# Altium schematic sheet ChopperAmp.SchDoc
size A3; Author: P Shersby; SheetNumber: 1; SheetTotal: 1; DocumentName: Sampling Gate Assembly
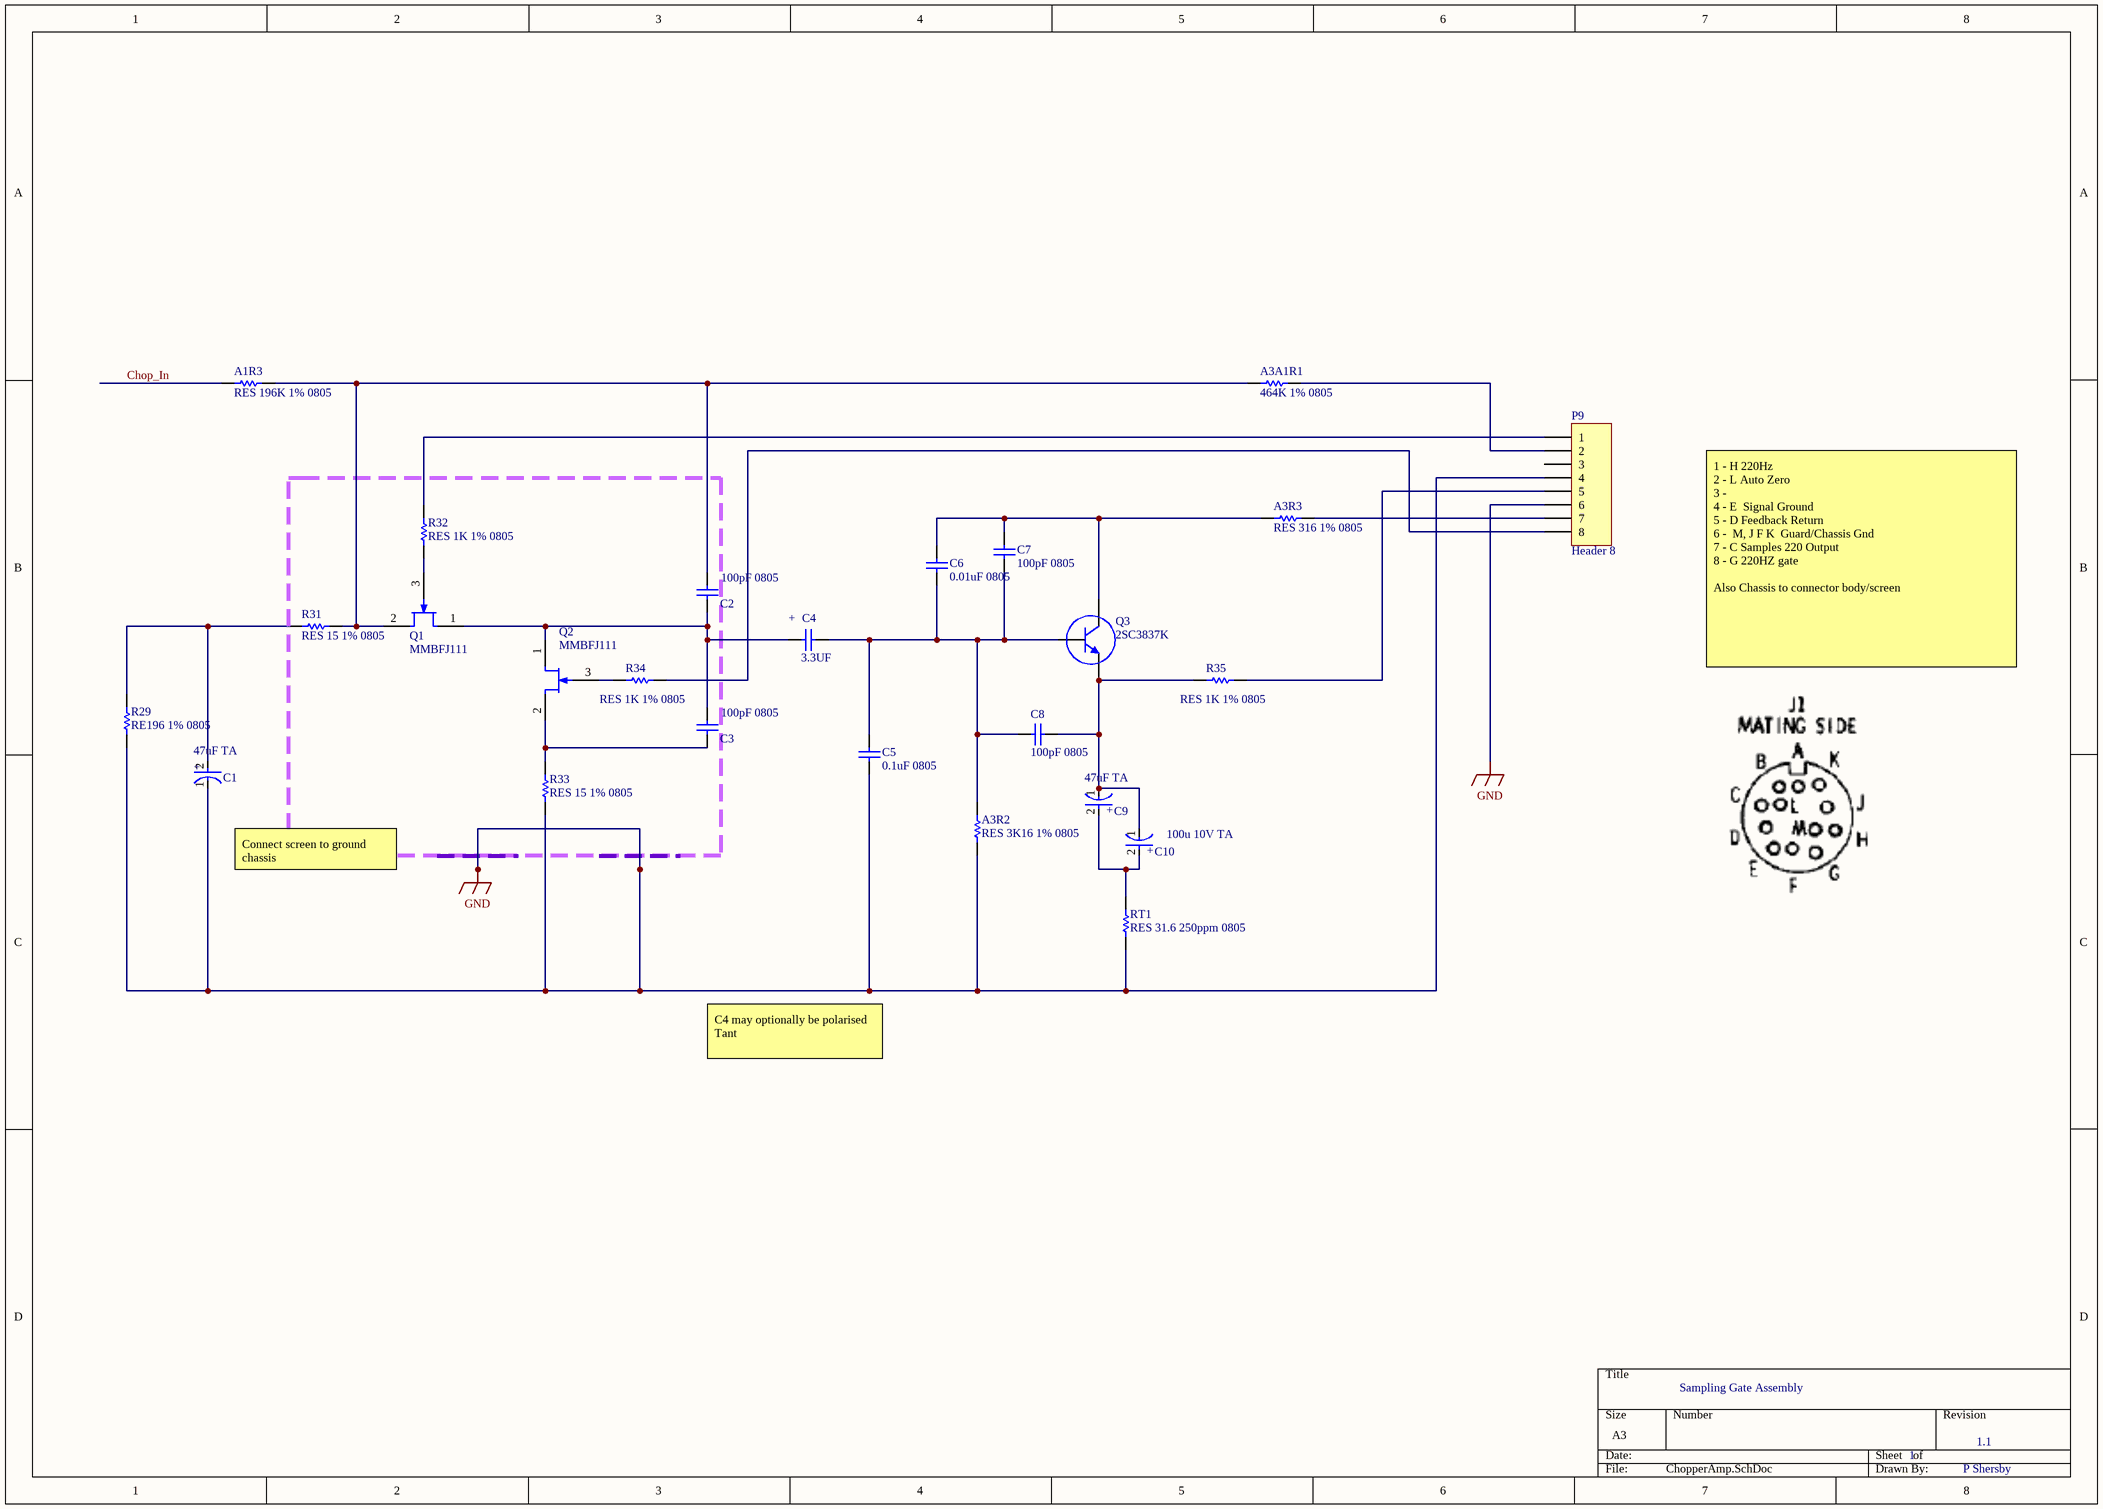
[diagram p0: ChopperAmp.SchDoc]

## Parts
A1R3  RES 196K 1% 0805  [RESC2013X70X40LL20T20]
A3A1R1  464K 1% 0805  [RESC2013X70X40LL20T20]
A3R2  RES 3K16 1% 0805  [RESC2013X70X40LL20T20]
A3R3  RES 316 1% 0805  [RESC2013X70X40LL20T20]
C1  47uF TA  [FP-TAJB-MFG]
C2  100pF 0805  [CAPC2113X88X50NL30T25]
C3  100pF 0805  [CAPC2113X88X50NL30T25]
C4  3.3UF  [CAPC1206(3216)150_L]
C5  0.1uF 0805  [CAPC2113X88X50NL30T25]
C6  0.01uF 0805  [CAPC2113X88X50NL30T25]
C7  100pF 0805  [CAPC2113X88X50NL30T25]
C8  100pF 0805  [CAPC2113X88X50NL30T25]
C9  47uF TA  [FP-TAJB-MFG]
C10  100u 10V TA  [FP-TPE-D4-MFG]
P9  Header 8  [HDR1X8]
Q1  MMBFJ111  [ONSC-SOT-23-3-318-08_V]
Q2  MMBFJ111  [ONSC-SOT-23-3-318-08_V]
Q3  2SC3837K  [SC-59]
R29  RE196 1% 0805  [RESC2013X70X40LL20T20]
R31  RES 15 1% 0805  [RESC2013X70X40LL20T20]
R32  RES 1K 1% 0805  [RESC2013X70X40LL20T20]
R33  RES 15 1% 0805  [RESC2013X70X40LL20T20]
R34  RES 1K 1% 0805  [RESC2013X70X40LL20T20]
R35  RES 1K 1% 0805  [RESC2013X70X40LL20T20]
RT1  RES 31.6 250ppm 0805  [RESC2013X70X40LL20T20]
SC1  ScreenConnection  [ScreenConnection]  (value not drawn)
SC2  ScreenConnection  [ScreenConnection]  (value not drawn)

## Nets
GND: A3R2.1 C1.1(C) C5.2 P9.4 P9.6 R29.2 R33.2 RT1.1 SC1.1 SC2.1
Chop_In: A1R3.1
NetA1R3_2: A1R3.2 A3A1R1.1 C2.2 Q1.2(S) R31.1
NetA3A1R1_2: A3A1R1.2 P9.2
NetA3R2_2: A3R2.2 C4.2 C5.1 C6.2 C7.2 C8.2 Q3.2(B)
NetA3R3_1: A3R3.1 C6.1 C7.1 Q3.1(C)
NetA3R3_2: A3R3.2 P9.7
NetC1_2: C1.2(A) R29.1 R31.2
NetC2_1: C2.1 C3.2 C4.1 Q1.1(D) Q2.1(D)
NetC3_1: C3.1 Q2.2(S) R33.1
NetC8_1: C8.1 C9.1(C) C10.1(C) Q3.3(E) R35.1
NetC9_2: C9.2(A) C10.2(A) RT1.2
NetP9_1: P9.1 R32.1
NetP9_5: P9.5 R35.2
NetP9_8: P9.8 R34.2
NetQ1_3: Q1.3(G) R32.2
NetQ2_3: Q2.3(G) R34.1

Not connected (* = marked no-connect by the designer): P9 3

## Notes on the sheet
- (near C4) +
- 1 - H 220Hz
  2 - L Auto Zero
  3 -
  4 - E  Signal Ground
  5 - D Feedback Return
  6 -  M, J F K  Guard/Chassis Gnd
  7 - C Samples 220 Output
  8 - G 220HZ gate
  Also Chassis to connector body/screen
- Connect screen to ground chassis
- C4 may optionally be polarised Tant
- 1.1
- (in symbol CMP-04424-000035-1) +
- (in symbol CMP-05428-000010-1) +

## Library data of the parts
A1R3 = CMP-2001-00110-5: Resistor 196K 1% 0805  1/8W 10ppm/C; Manufacturer: Panasonic; Voltage Rating: 150 V; Package Quantity: 5000; PackageDescription: 2-Pin Surface Mount Device, Body 2 x 1.25 mm; Mounting Technology: Surface Mount; ComponentLink2URL: http://industrial.panasonic.com/cdbs/www-data/pdf/RDA0000/AOA0000C86.pdf; DatasheetVersion: 04/2015; ComponentLink1URL: http://www.panasonic.com/; Mount: Surface Mount; ComponentLink1Description: Manufacturer URL; RoHSCompliant: true; PackageReference: 0805; Min Operating Temperature: -55 degC; Height: 0.6 mm; ComponentLink2Description: Datasheet; Max Operating Temperature: 155 degC; Length: 2 mm; Packaging: Tape and Reel; REACH SVHC: Yes
A3A1R1 = CMP-2001-00110-5: Resistor 464K 1% 0805   0.2W 10ppm/C; Manufacturer: Panasonic; Voltage Rating: 150 V; Package Quantity: 5000; PackageDescription: 2-Pin Surface Mount Device, Body 2 x 1.25 mm; Mounting Technology: Surface Mount; ComponentLink2URL: http://industrial.panasonic.com/cdbs/www-data/pdf/RDA0000/AOA0000C86.pdf; DatasheetVersion: 04/2015; ComponentLink1URL: http://www.panasonic.com/; Mount: Surface Mount; ComponentLink1Description: Manufacturer URL; RoHSCompliant: true; PackageReference: 0805; Min Operating Temperature: -55 degC; Height: 0.6 mm; ComponentLink2Description: Datasheet; Max Operating Temperature: 155 degC; Length: 2 mm; Packaging: Tape and Reel; REACH SVHC: Yes
A3R2 = CMP-2001-00110-5: Resistor 3K!6 1% 0805  1/8W 10ppm/C; Manufacturer: Panasonic; Voltage Rating: 150 V; Package Quantity: 5000; PackageDescription: 2-Pin Surface Mount Device, Body 2 x 1.25 mm; Mounting Technology: Surface Mount; ComponentLink2URL: http://industrial.panasonic.com/cdbs/www-data/pdf/RDA0000/AOA0000C86.pdf; DatasheetVersion: 04/2015; ComponentLink1URL: http://www.panasonic.com/; Mount: Surface Mount; ComponentLink1Description: Manufacturer URL; RoHSCompliant: true; PackageReference: 0805; Min Operating Temperature: -55 degC; Height: 0.6 mm; ComponentLink2Description: Datasheet; Max Operating Temperature: 155 degC; Length: 2 mm; Packaging: Tape and Reel; REACH SVHC: Yes
A3R3 = CMP-2001-00110-5: Resistor 316 1% 0805  1/8W 10ppm/C; Manufacturer: Panasonic; Voltage Rating: 150 V; Package Quantity: 5000; PackageDescription: 2-Pin Surface Mount Device, Body 2 x 1.25 mm; Mounting Technology: Surface Mount; ComponentLink2URL: http://industrial.panasonic.com/cdbs/www-data/pdf/RDA0000/AOA0000C86.pdf; DatasheetVersion: 04/2015; ComponentLink1URL: http://www.panasonic.com/; Mount: Surface Mount; ComponentLink1Description: Manufacturer URL; RoHSCompliant: true; PackageReference: 0805; Min Operating Temperature: -55 degC; Height: 0.6 mm; ComponentLink2Description: Datasheet; Max Operating Temperature: 155 degC; Length: 2 mm; Packaging: Tape and Reel; REACH SVHC: Yes
C1 C9 = CMP-04424-000035-1: 47uF Tant 4V 1411; Manufacturer: AVX Corporation; Manufacturer Part Number: TAJB475K010RNJ; Life: 1000Hours; Material: Tantalum; Ripple Current: 146mA; Value: 4.7uF; Esr: 4Ω; Voltage Rating: 10V; Dissipation Factor: 6%; Tolerance: 10%; Footprint Url: https://www.avx.com/docs/techinfo/TechSumAppGuide.pdf; Category: Cap; Device Class L1: Passive Components; ComponentLink2URL: http://datasheets.avx.com/TAJ.pdf; Height: 2.1mm; RoHS: TRUE; Automotive: No; Temperature: -55°C to +125°C; Lead Free: Yes; Digikey Description: CAP TANT 4.7UF 10% 10V 1411; Package: TAJB; Device Class L2: Capacitors; Mouser Description: Cap Tant Solid 4.7uF 10V B CASE 10% (3.5 X 2.8 X 1.9mm) SMD 3528-21 4 Ohm 125 C T/R; ComponentLink2Description: Datasheet; Device Class L3: Tantalum Capacitors; Temperature Range High: +125°C; Temperature Range Low: -55°C; Octopart: https://octopart.com/tajb475k010rnj-avx-2636133; Capacitance: 4.7uF
C2 C3 C5-C8 = CMP-2007-00001-1: Manufacturer: Kemet; Part Number: C0805X474K4RACTU
C4 = CMP-1590-00001-1: 1206 (3216 Metric) Chip Capacitor; Case-Metric: 3216; Case-EIA: 1206; PackageReference: CAPC1206(3216)150
C10 = CMP-05428-000010-1: CAP TANT 100u 10V; Manufacturer Part Number: 6TPE330MAA; Manufacturer: Panasonic Electronic; Tolerance: 20%; Value: 330uF; Ripple Current: 4400mA; Voltage Rating: 6.3V; Life: 1000Hours; Leakage Current: 207.9uA; Esr: 10mΩ; Material: Polymer; Dissipation Factor: 10%; Temperature Range High: +105°C; Mouser Description: Tantalum Capacitors - Polymer SMD 6.3volts 330uF ESR 10mohm; Device Class L3: Polymer Capacitors; ComponentLink2URL: https://industrial.panasonic.com/cdbs/www-data/pdf/AAA8000/AAA8000C36.pdf; Digikey Description: CAP TANT POLY 330UF 6.3V 2917; Temperature: -55°C to +105°C; Category: Cap; Package: TPE-D4; Temperature Range Low: -55°C; Footprint Url: https://industrial.panasonic.com/cdbs/www-data/pdf/AAA8000/AAA8000COL85.pdf; Height: 4mm; Octopart: https://octopart.com/6tpe330maa-panasonic-29487875; ComponentLink2Description: Datasheet; Device Class L1: Passive Components; Device Class L2: Capacitors; Lead Free: Yes; RoHS: TRUE; Automotive: No; Capacitance: 330uF
P9 = Header 8: Header, 8-Pin; LatestRevisionDate: 17-Jul-2002; LatestRevisionNote: Re-released for DXP Platform.; Publisher: Altium Limited
Q1 Q2 = CMP-1062-00038-1: JFET - VHF / UJFET Chopper; PartNumber: MMBFJ310LT3; Manufacturer: On Semiconductor; IDSS Min (uA): 24000; Crss Max (pF): 2.5; Ciss Max (pF): 5; Channel Polarity: N Channel; V(BR)GSS Min (V): 25; Packing: Tape and Reel; IDSS Max (uA): 60000; ComponentLink1URL: http://www.onsemi.com/; PackageReference: SOT-23-3-318-08; ComponentLink3URL: http://www.onsemi.cn/pub_link/Collateral/318-08.PDF; PackageDescription: 3-Pin Small Outline Transistor, Body 2.92 x 1.3 mm, Pitch 0.95 mm; DatasheetVersion: Rev. 7; ComponentLink2URL: http://www.onsemi.cn/pub_link/Collateral/MMBFJ309LT1-D.PDF; ComponentLink2Description: Datasheet; PackageVersion: Rev. AP, 11/2009; ComponentLink1Description: Manufacturer URL; ComponentLink3Description: Package Specification; Mounting Technology: Surface Mount
Q3 = NPN: pin to pad: 1>3 3>1
R29 = CMP-2001-00110-5: Resistor 196 1% 0805  0.2W 10ppm/C; Manufacturer: Panasonic; Voltage Rating: 150 V; Package Quantity: 5000; PackageDescription: 2-Pin Surface Mount Device, Body 2 x 1.25 mm; Mounting Technology: Surface Mount; ComponentLink2URL: http://industrial.panasonic.com/cdbs/www-data/pdf/RDA0000/AOA0000C86.pdf; DatasheetVersion: 04/2015; ComponentLink1URL: http://www.panasonic.com/; Mount: Surface Mount; ComponentLink1Description: Manufacturer URL; RoHSCompliant: true; PackageReference: 0805; Min Operating Temperature: -55 degC; Height: 0.6 mm; ComponentLink2Description: Datasheet; Max Operating Temperature: 155 degC; Length: 2 mm; Packaging: Tape and Reel; REACH SVHC: Yes
R31 R33 = CMP-2001-00110-5: Resistor 15 1% 0805  0.2W 10ppm/C; Manufacturer: Panasonic; Voltage Rating: 150 V; Package Quantity: 5000; PackageDescription: 2-Pin Surface Mount Device, Body 2 x 1.25 mm; Mounting Technology: Surface Mount; ComponentLink2URL: http://industrial.panasonic.com/cdbs/www-data/pdf/RDA0000/AOA0000C86.pdf; DatasheetVersion: 04/2015; ComponentLink1URL: http://www.panasonic.com/; Mount: Surface Mount; ComponentLink1Description: Manufacturer URL; RoHSCompliant: true; PackageReference: 0805; Min Operating Temperature: -55 degC; Height: 0.6 mm; ComponentLink2Description: Datasheet; Max Operating Temperature: 155 degC; Length: 2 mm; Packaging: Tape and Reel; REACH SVHC: Yes
R32 = CMP-2001-00110-5: Resistor 1K 1% 0805  0.2W 10ppm/C; Manufacturer: Panasonic; Voltage Rating: 150 V; Package Quantity: 5000; PackageDescription: 2-Pin Surface Mount Device, Body 2 x 1.25 mm; Mounting Technology: Surface Mount; ComponentLink2URL: http://industrial.panasonic.com/cdbs/www-data/pdf/RDA0000/AOA0000C86.pdf; DatasheetVersion: 04/2015; ComponentLink1URL: http://www.panasonic.com/; Mount: Surface Mount; ComponentLink1Description: Manufacturer URL; RoHSCompliant: true; PackageReference: 0805; Min Operating Temperature: -55 degC; Height: 0.6 mm; ComponentLink2Description: Datasheet; Max Operating Temperature: 155 degC; Length: 2 mm; Packaging: Tape and Reel; REACH SVHC: Yes
R34 R35 = CMP-2001-00110-5: Resistor 1K1% 0805  0.2W 10ppm/C; Manufacturer: Panasonic; Voltage Rating: 150 V; Package Quantity: 5000; PackageDescription: 2-Pin Surface Mount Device, Body 2 x 1.25 mm; Mounting Technology: Surface Mount; ComponentLink2URL: http://industrial.panasonic.com/cdbs/www-data/pdf/RDA0000/AOA0000C86.pdf; DatasheetVersion: 04/2015; ComponentLink1URL: http://www.panasonic.com/; Mount: Surface Mount; ComponentLink1Description: Manufacturer URL; RoHSCompliant: true; PackageReference: 0805; Min Operating Temperature: -55 degC; Height: 0.6 mm; ComponentLink2Description: Datasheet; Max Operating Temperature: 155 degC; Length: 2 mm; Packaging: Tape and Reel; REACH SVHC: Yes
RT1 = CMP-2001-00110-5: Manufacturer: Panasonic; Voltage Rating: 150 V; Package Quantity: 5000; PackageDescription: 2-Pin Surface Mount Device, Body 2 x 1.25 mm; Mounting Technology: Surface Mount; ComponentLink2URL: http://industrial.panasonic.com/cdbs/www-data/pdf/RDA0000/AOA0000C86.pdf; DatasheetVersion: 04/2015; ComponentLink1URL: http://www.panasonic.com/; Mount: Surface Mount; ComponentLink1Description: Manufacturer URL; RoHSCompliant: true; PackageReference: 0805; Min Operating Temperature: -55 degC; Height: 0.6 mm; ComponentLink2Description: Datasheet; Max Operating Temperature: 155 degC; Length: 2 mm; Packaging: Tape and Reel; REACH SVHC: Yes